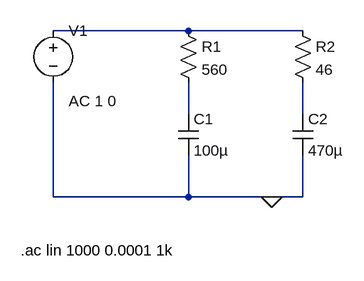
[diagram p0: schematic PoloBajaFreq.asc]
PoloBajaFreq.asc, the LTspice schematic file:
Version 4
SHEET 1 880 680
WIRE 160 112 -48 112
WIRE 336 112 160 112
WIRE 160 240 160 192
WIRE 336 240 336 192
WIRE -48 368 -48 192
WIRE 160 368 160 304
WIRE 160 368 -48 368
WIRE 288 368 160 368
WIRE 336 368 336 304
WIRE 336 368 288 368
FLAG 288 368 0
SYMBOL voltage -48 96 R0
WINDOW 123 24 124 Left 2
WINDOW 39 0 0 Left 0
SYMATTR InstName V1
SYMATTR Value ""
SYMATTR Value2 AC 1 0
SYMBOL res 144 96 R0
SYMATTR InstName R1
SYMATTR Value 560
SYMBOL res 320 96 R0
SYMATTR InstName R2
SYMATTR Value 46
SYMBOL cap 144 240 R0
SYMATTR InstName C1
SYMATTR Value 100µ
SYMBOL cap 320 240 R0
SYMATTR InstName C2
SYMATTR Value 470µ
TEXT -98 450 Left 2 !.ac lin 1000 0.0001 1k

The netlist it stands for:
* PoloBajaFreq.asc
V1 N001 0 AC 1 0
R1 N001 N002 560
R2 N001 N003 46
C1 N002 0 100µ
C2 N003 0 470µ
.ac lin 1000 0.0001 1k
.backanno
.end